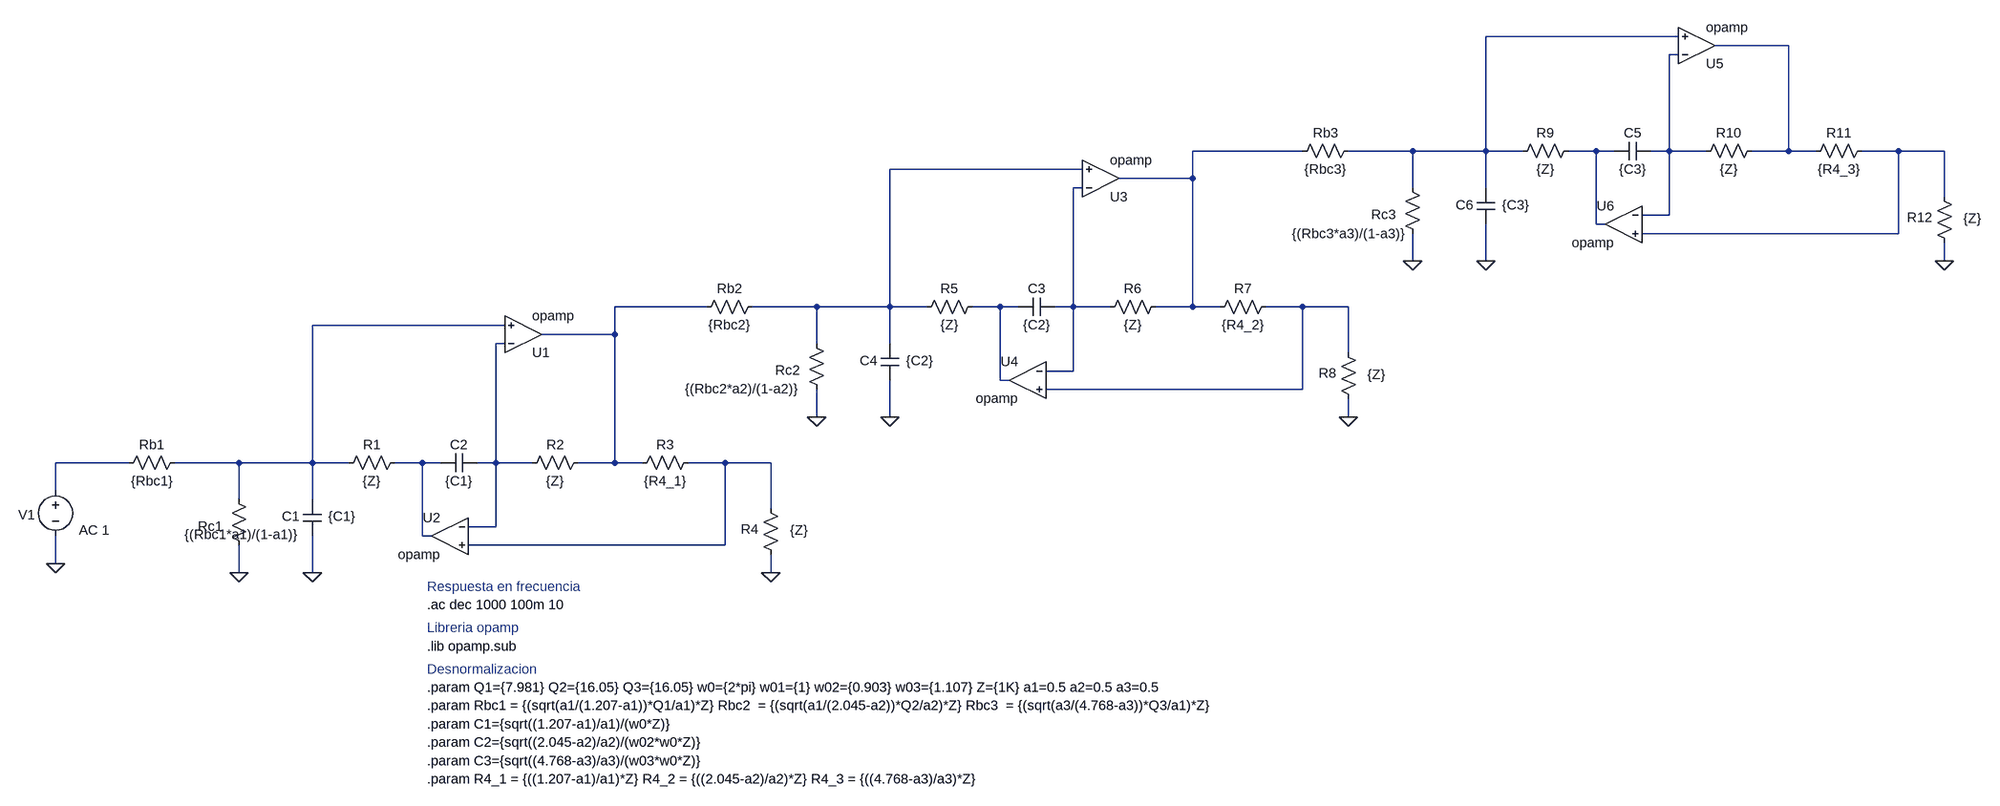
[diagram p0: schematic Circuito_Semana_4_bis_bis v2.asc]
Circuito_Semana_4_bis_bis v2.asc, the LTspice schematic file:
Version 4
SHEET 1 968 1144
WIRE -288 -624 -624 -624
WIRE -96 -608 -224 -608
WIRE -288 -592 -304 -592
WIRE -944 -384 -1136 -384
WIRE -752 -384 -864 -384
WIRE -624 -384 -624 -624
WIRE -624 -384 -752 -384
WIRE -560 -384 -624 -384
WIRE -432 -384 -480 -384
WIRE -400 -384 -432 -384
WIRE -304 -384 -304 -592
WIRE -304 -384 -336 -384
WIRE -240 -384 -304 -384
WIRE -96 -384 -96 -608
WIRE -96 -384 -160 -384
WIRE -48 -384 -96 -384
WIRE 96 -384 32 -384
WIRE 176 -384 96 -384
WIRE -1328 -352 -1664 -352
WIRE -1136 -336 -1136 -384
WIRE -1136 -336 -1264 -336
WIRE -1328 -320 -1344 -320
WIRE -752 -320 -752 -384
WIRE -624 -320 -624 -384
WIRE 176 -304 176 -384
WIRE -304 -272 -304 -384
WIRE -304 -272 -352 -272
WIRE -432 -256 -432 -384
WIRE -416 -256 -432 -256
WIRE 96 -240 96 -384
WIRE 96 -240 -352 -240
WIRE -752 -192 -752 -240
WIRE -624 -192 -624 -256
WIRE 176 -192 176 -224
WIRE -1984 -112 -2144 -112
WIRE -1792 -112 -1904 -112
WIRE -1664 -112 -1664 -352
WIRE -1664 -112 -1792 -112
WIRE -1600 -112 -1664 -112
WIRE -1472 -112 -1520 -112
WIRE -1440 -112 -1472 -112
WIRE -1344 -112 -1344 -320
WIRE -1344 -112 -1376 -112
WIRE -1280 -112 -1344 -112
WIRE -1136 -112 -1136 -336
WIRE -1136 -112 -1200 -112
WIRE -1088 -112 -1136 -112
WIRE -944 -112 -1008 -112
WIRE -864 -112 -944 -112
WIRE -2336 -80 -2672 -80
WIRE -2144 -64 -2144 -112
WIRE -2144 -64 -2272 -64
WIRE -2336 -48 -2352 -48
WIRE -1792 -48 -1792 -112
WIRE -1664 -48 -1664 -112
WIRE -864 -32 -864 -112
WIRE -1344 0 -1344 -112
WIRE -1344 0 -1392 0
WIRE -1472 16 -1472 -112
WIRE -1456 16 -1472 16
WIRE -944 32 -944 -112
WIRE -944 32 -1392 32
WIRE -1792 80 -1792 32
WIRE -1664 80 -1664 16
WIRE -864 80 -864 48
WIRE -2992 160 -3120 160
WIRE -2800 160 -2912 160
WIRE -2672 160 -2672 -80
WIRE -2672 160 -2800 160
WIRE -2608 160 -2672 160
WIRE -2480 160 -2528 160
WIRE -2448 160 -2480 160
WIRE -2352 160 -2352 -48
WIRE -2352 160 -2384 160
WIRE -2288 160 -2352 160
WIRE -2144 160 -2144 -64
WIRE -2144 160 -2208 160
WIRE -2096 160 -2144 160
WIRE -1952 160 -2016 160
WIRE -1872 160 -1952 160
WIRE -3120 208 -3120 160
WIRE -2800 224 -2800 160
WIRE -2672 224 -2672 160
WIRE -1872 240 -1872 160
WIRE -2352 272 -2352 160
WIRE -2352 272 -2400 272
WIRE -2480 288 -2480 160
WIRE -2464 288 -2480 288
WIRE -1952 304 -1952 160
WIRE -1952 304 -2400 304
WIRE -3120 336 -3120 288
WIRE -2800 352 -2800 304
WIRE -2672 352 -2672 288
WIRE -1872 352 -1872 320
FLAG -3120 336 0
FLAG -2800 352 0
FLAG -2672 352 0
FLAG -1872 352 0
FLAG -1792 80 0
FLAG -1664 80 0
FLAG -864 80 0
FLAG -752 -192 0
FLAG -624 -192 0
FLAG 176 -192 0
SYMBOL res -2784 320 R180
WINDOW 0 45 49 Left 2
WINDOW 3 -86 35 Left 2
SYMATTR InstName Rc1
SYMATTR Value {(Rbc1*a1)/(1-a1)}
SYMBOL cap -2384 144 R90
WINDOW 0 0 32 VBottom 2
WINDOW 3 32 32 VTop 2
SYMATTR InstName C2
SYMATTR Value {C1}
SYMBOL OpAmps\\opamp -2304 0 M180
SYMATTR InstName U1
SYMBOL voltage -3120 192 R0
WINDOW 0 -65 59 Left 2
WINDOW 3 41 58 Left 2
WINDOW 123 41 86 Left 2
WINDOW 39 0 0 Left 0
SYMATTR InstName V1
SYMATTR Value ""
SYMATTR Value2 AC 1
SYMBOL res -2896 144 R90
WINDOW 0 0 56 VBottom 2
WINDOW 3 32 56 VTop 2
SYMATTR InstName Rb1
SYMATTR Value {Rbc1}
SYMBOL cap -2688 224 R0
WINDOW 0 -37 30 Left 2
WINDOW 3 44 30 Left 2
SYMATTR InstName C1
SYMATTR Value {C1}
SYMBOL res -2512 144 R90
WINDOW 0 0 56 VBottom 2
WINDOW 3 32 56 VTop 2
SYMATTR InstName R1
SYMATTR Value {Z}
SYMBOL res -2192 144 R90
WINDOW 0 0 56 VBottom 2
WINDOW 3 32 56 VTop 2
SYMATTR InstName R2
SYMATTR Value {Z}
SYMBOL res -2000 144 R90
WINDOW 0 0 56 VBottom 2
WINDOW 3 32 56 VTop 2
SYMATTR InstName R3
SYMATTR Value {R4_1}
SYMBOL res -1856 336 R180
WINDOW 0 37 60 Left 2
WINDOW 3 -49 58 Left 2
SYMATTR InstName R4
SYMATTR Value {Z}
SYMBOL OpAmps\\opamp -2432 224 M0
SYMATTR InstName U2
SYMBOL res -1776 48 R180
WINDOW 0 45 49 Left 2
WINDOW 3 48 17 Left 2
SYMATTR InstName Rc2
SYMATTR Value {(Rbc2*a2)/(1-a2)}
SYMBOL cap -1376 -128 R90
WINDOW 0 0 32 VBottom 2
WINDOW 3 32 32 VTop 2
SYMATTR InstName C3
SYMATTR Value {C2}
SYMBOL OpAmps\\opamp -1296 -272 M180
SYMATTR InstName U3
SYMBOL res -1888 -128 R90
WINDOW 0 0 56 VBottom 2
WINDOW 3 32 56 VTop 2
SYMATTR InstName Rb2
SYMATTR Value {Rbc2}
SYMBOL cap -1680 -48 R0
WINDOW 0 -37 30 Left 2
WINDOW 3 44 30 Left 2
SYMATTR InstName C4
SYMATTR Value {C2}
SYMBOL res -1504 -128 R90
WINDOW 0 0 56 VBottom 2
WINDOW 3 32 56 VTop 2
SYMATTR InstName R5
SYMATTR Value {Z}
SYMBOL res -1184 -128 R90
WINDOW 0 0 56 VBottom 2
WINDOW 3 32 56 VTop 2
SYMATTR InstName R6
SYMATTR Value {Z}
SYMBOL res -992 -128 R90
WINDOW 0 0 56 VBottom 2
WINDOW 3 32 56 VTop 2
SYMATTR InstName R7
SYMATTR Value {R4_2}
SYMBOL res -848 64 R180
WINDOW 0 37 60 Left 2
WINDOW 3 -49 58 Left 2
SYMATTR InstName R8
SYMATTR Value {Z}
SYMBOL OpAmps\\opamp -1424 -48 M0
SYMATTR InstName U4
SYMBOL res -736 -224 R180
WINDOW 0 45 49 Left 2
WINDOW 3 29 16 Left 2
SYMATTR InstName Rc3
SYMATTR Value {(Rbc3*a3)/(1-a3)}
SYMBOL cap -336 -400 R90
WINDOW 0 0 32 VBottom 2
WINDOW 3 32 32 VTop 2
SYMATTR InstName C5
SYMATTR Value {C3}
SYMBOL OpAmps\\opamp -256 -544 M180
SYMATTR InstName U5
SYMBOL res -848 -400 R90
WINDOW 0 0 56 VBottom 2
WINDOW 3 32 56 VTop 2
SYMATTR InstName Rb3
SYMATTR Value {Rbc3}
SYMBOL cap -640 -320 R0
WINDOW 0 -37 30 Left 2
WINDOW 3 44 30 Left 2
SYMATTR InstName C6
SYMATTR Value {C3}
SYMBOL res -464 -400 R90
WINDOW 0 0 56 VBottom 2
WINDOW 3 32 56 VTop 2
SYMATTR InstName R9
SYMATTR Value {Z}
SYMBOL res -144 -400 R90
WINDOW 0 0 56 VBottom 2
WINDOW 3 32 56 VTop 2
SYMATTR InstName R10
SYMATTR Value {Z}
SYMBOL res 48 -400 R90
WINDOW 0 0 56 VBottom 2
WINDOW 3 32 56 VTop 2
SYMATTR InstName R11
SYMATTR Value {R4_3}
SYMBOL res 192 -208 R180
WINDOW 0 37 60 Left 2
WINDOW 3 -49 58 Left 2
SYMATTR InstName R12
SYMATTR Value {Z}
SYMBOL OpAmps\\opamp -384 -320 M0
SYMATTR InstName U6
TEXT -2472 408 Left 2 !.ac dec 1000 100m 10
TEXT -2472 480 Left 2 !.lib opamp.sub
TEXT -2472 376 Left 2 ;Respuesta en frecuencia
TEXT -2472 448 Left 2 ;Libreria opamp
TEXT -2472 552 Left 2 !.param Q1={7.981} Q2={16.05} Q3={16.05} w0={2*pi} w01={1} w02={0.903} w03={1.107} Z={1K} a1=0.5 a2=0.5 a3=0.5
TEXT -2472 616 Left 2 !.param C1={sqrt((1.207-a1)/a1)/(w0*Z)}
TEXT -2472 520 Left 2 ;Desnormalizacion
TEXT -2472 648 Left 2 !.param C2={sqrt((2.045-a2)/a2)/(w02*w0*Z)}
TEXT -2472 680 Left 2 !.param C3={sqrt((4.768-a3)/a3)/(w03*w0*Z)}
TEXT -2472 584 Left 2 !.param Rbc1 = {(sqrt(a1/(1.207-a1))*Q1/a1)*Z} Rbc2  = {(sqrt(a1/(2.045-a2))*Q2/a2)*Z} Rbc3  = {(sqrt(a3/(4.768-a3))*Q3/a1)*Z}
TEXT -2472 712 Left 2 !.param R4_1 = {((1.207-a1)/a1)*Z} R4_2 = {((2.045-a2)/a2)*Z} R4_3 = {((4.768-a3)/a3)*Z}

The netlist it stands for:
* Circuito_Semana_4_bis_bis v2.asc
Rc1 0 N012 {(Rbc1*a1)/(1-a1)}
C2 N013 N015 {C1}
XU1 N013 N012 N009 opamp Aol=100K GBW=10Meg  ; pins invin noninvin out
V1 N014 0 AC 1
Rb1 N012 N014 {Rbc1}
C1 N012 0 {C1}
R1 N015 N012 {Z}
R2 N009 N013 {Z}
R3 N016 N009 {R4_1}
R4 0 N016 {Z}
XU2 N013 N016 N015 opamp Aol=100K GBW=10Meg  ; pins invin noninvin out
Rc2 0 N007 {(Rbc2*a2)/(1-a2)}
C3 N008 N010 {C2}
XU3 N008 N007 N004 opamp Aol=100K GBW=10Meg  ; pins invin noninvin out
Rb2 N007 N009 {Rbc2}
C4 N007 0 {C2}
R5 N010 N007 {Z}
R6 N004 N008 {Z}
R7 N011 N004 {R4_2}
R8 0 N011 {Z}
XU4 N008 N011 N010 opamp Aol=100K GBW=10Meg  ; pins invin noninvin out
Rc3 0 N001 {(Rbc3*a3)/(1-a3)}
C5 N003 N005 {C3}
XU5 N003 N001 N002 opamp Aol=100K GBW=10Meg  ; pins invin noninvin out
Rb3 N001 N004 {Rbc3}
C6 N001 0 {C3}
R9 N005 N001 {Z}
R10 N002 N003 {Z}
R11 N006 N002 {R4_3}
R12 0 N006 {Z}
XU6 N003 N006 N005 opamp Aol=100K GBW=10Meg  ; pins invin noninvin out
.ac dec 1000 100m 10
.lib opamp.sub
* Respuesta en frecuencia
* Libreria opamp
.param Q1={7.981} Q2={16.05} Q3={16.05} w0={2*pi} w01={1} w02={0.903} w03={1.107} Z={1K} a1=0.5 a2=0.5 a3=0.5
.param C1={sqrt((1.207-a1)/a1)/(w0*Z)}
* Desnormalizacion
.param C2={sqrt((2.045-a2)/a2)/(w02*w0*Z)}
.param C3={sqrt((4.768-a3)/a3)/(w03*w0*Z)}
.param Rbc1 = {(sqrt(a1/(1.207-a1))*Q1/a1)*Z} Rbc2  = {(sqrt(a1/(2.045-a2))*Q2/a2)*Z} Rbc3  = {(sqrt(a3/(4.768-a3))*Q3/a1)*Z}
.param R4_1 = {((1.207-a1)/a1)*Z} R4_2 = {((2.045-a2)/a2)*Z} R4_3 = {((4.768-a3)/a3)*Z}
.backanno
.end